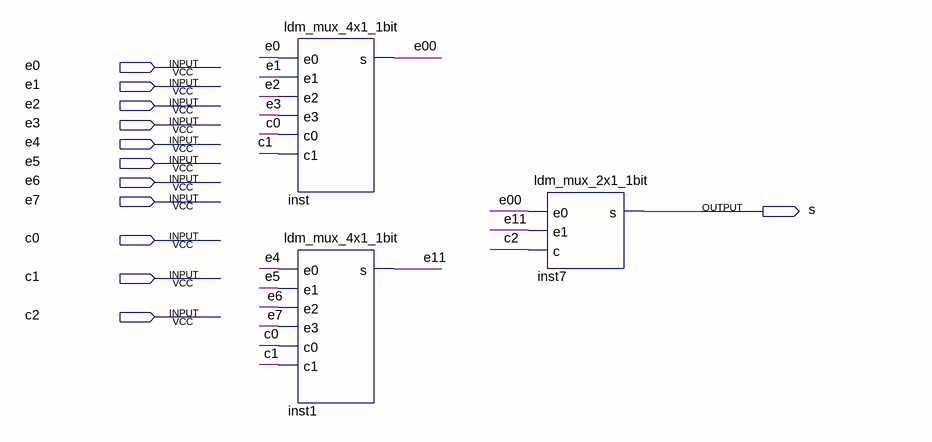
[diagram p0: schematic sheet]
// Quartus schematic ldm_mux_8x1_1bit.bdf as structural Verilog: 3 symbols, 12 pins
module ldm_mux_8x1_1bit (
  input  e0,
  input  e1,
  input  e2,
  input  e3,
  input  e4,
  input  e5,
  input  e6,
  input  e7,
  input  c0,
  input  c1,
  input  c2,
  output s
);

  wire e00, e11;

  ldm_mux_4x1_1bit inst (.e0(e0), .e1(e1), .e2(e2), .e3(e3), .c0(c0), .c1(c1), .s(e00));
  ldm_mux_4x1_1bit inst1 (.e0(e4), .e1(e5), .e2(e6), .e3(e7), .c0(c0), .c1(c1), .s(e11));
  ldm_mux_2x1_1bit inst7 (.e0(e00), .e1(e11), .c(c2), .s(s));
endmodule
